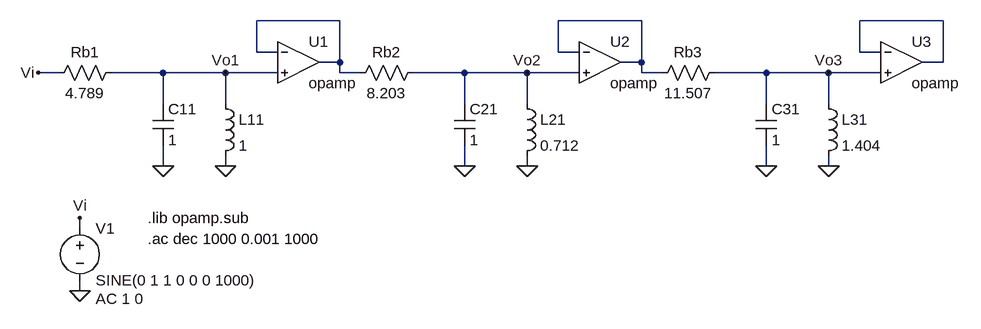
[diagram p0: schematic cheby_pasivo_bp_3_orden.asc]
cheby_pasivo_bp_3_orden.asc, the LTspice schematic file:
Version 4
SHEET 1 880 680
WIRE -80 -16 -208 -16
WIRE 384 -16 256 -16
WIRE 848 -16 720 -16
WIRE -208 32 -208 -16
WIRE -176 32 -208 32
WIRE 256 32 256 -16
WIRE 288 32 256 32
WIRE 720 32 720 -16
WIRE 752 32 720 32
WIRE -80 48 -80 -16
WIRE -80 48 -112 48
WIRE 384 48 384 -16
WIRE 384 48 352 48
WIRE 848 48 848 -16
WIRE 848 48 816 48
WIRE -512 64 -544 64
WIRE -352 64 -432 64
WIRE -256 64 -352 64
WIRE -176 64 -256 64
WIRE -80 64 -80 48
WIRE -48 64 -80 64
WIRE 112 64 32 64
WIRE 208 64 112 64
WIRE 288 64 208 64
WIRE 384 64 384 48
WIRE 416 64 384 64
WIRE 576 64 496 64
WIRE 672 64 576 64
WIRE 752 64 672 64
WIRE -352 112 -352 64
WIRE -256 112 -256 64
WIRE 112 112 112 64
WIRE 208 112 208 64
WIRE 576 112 576 64
WIRE 672 112 672 64
WIRE -352 208 -352 176
WIRE -256 208 -256 192
WIRE 112 208 112 176
WIRE 208 208 208 192
WIRE 576 208 576 176
WIRE 672 208 672 192
WIRE -480 304 -480 288
WIRE -480 400 -480 384
FLAG -256 208 0
FLAG -352 208 0
FLAG -544 64 Vi
FLAG -256 64 Vo1
FLAG 208 208 0
FLAG 112 208 0
FLAG 208 64 Vo2
FLAG 672 208 0
FLAG 576 208 0
FLAG 672 64 Vo3
FLAG -480 400 0
FLAG -480 288 Vi
SYMBOL res -416 48 R90
WINDOW 0 0 56 VBottom 2
WINDOW 3 32 56 VTop 2
SYMATTR InstName Rb1
SYMATTR Value 4.789
SYMBOL ind -272 96 R0
SYMATTR InstName L11
SYMATTR Value 1
SYMBOL cap -368 112 R0
SYMATTR InstName C11
SYMATTR Value 1
SYMBOL Opamps\\opamp -144 -16 R0
SYMATTR InstName U1
SYMBOL res 48 48 R90
WINDOW 0 0 56 VBottom 2
WINDOW 3 32 56 VTop 2
SYMATTR InstName Rb2
SYMATTR Value 8.203
SYMBOL ind 192 96 R0
SYMATTR InstName L21
SYMATTR Value 0.712
SYMBOL cap 96 112 R0
SYMATTR InstName C21
SYMATTR Value 1
SYMBOL Opamps\\opamp 320 -16 R0
SYMATTR InstName U2
SYMBOL res 512 48 R90
WINDOW 0 0 56 VBottom 2
WINDOW 3 32 56 VTop 2
SYMATTR InstName Rb3
SYMATTR Value 11.507
SYMBOL ind 656 96 R0
SYMATTR InstName L31
SYMATTR Value 1.404
SYMBOL cap 560 112 R0
SYMATTR InstName C31
SYMATTR Value 1
SYMBOL Opamps\\opamp 784 -16 R0
SYMATTR InstName U3
SYMBOL voltage -480 288 R0
WINDOW 123 24 124 Left 2
WINDOW 39 0 0 Left 0
SYMATTR InstName V1
SYMATTR Value SINE(0 1 1 0 0 0 1000)
SYMATTR Value2 AC 1 0
TEXT -376 288 Left 2 !.lib opamp.sub
TEXT -376 320 Left 2 !.ac dec 1000 0.001 1000

The netlist it stands for:
* cheby_pasivo_bp_3_orden.asc
Rb1 Vo1 Vi 4.789
L11 Vo1 0 1
C11 Vo1 0 1
XU1 N001 Vo1 N001 opamp Aol=100K GBW=10Meg  ; pins invin noninvin out
Rb2 Vo2 N001 8.203
L21 Vo2 0 0.712
C21 Vo2 0 1
XU2 N002 Vo2 N002 opamp Aol=100K GBW=10Meg  ; pins invin noninvin out
Rb3 Vo3 N002 11.507
L31 Vo3 0 1.404
C31 Vo3 0 1
XU3 N003 Vo3 N003 opamp Aol=100K GBW=10Meg  ; pins invin noninvin out
V1 Vi 0 SINE(0 1 1 0 0 0 1000) AC 1 0
.lib opamp.sub
.ac dec 1000 0.001 1000
.backanno
.end